# Altium project dctr.PrjPCB
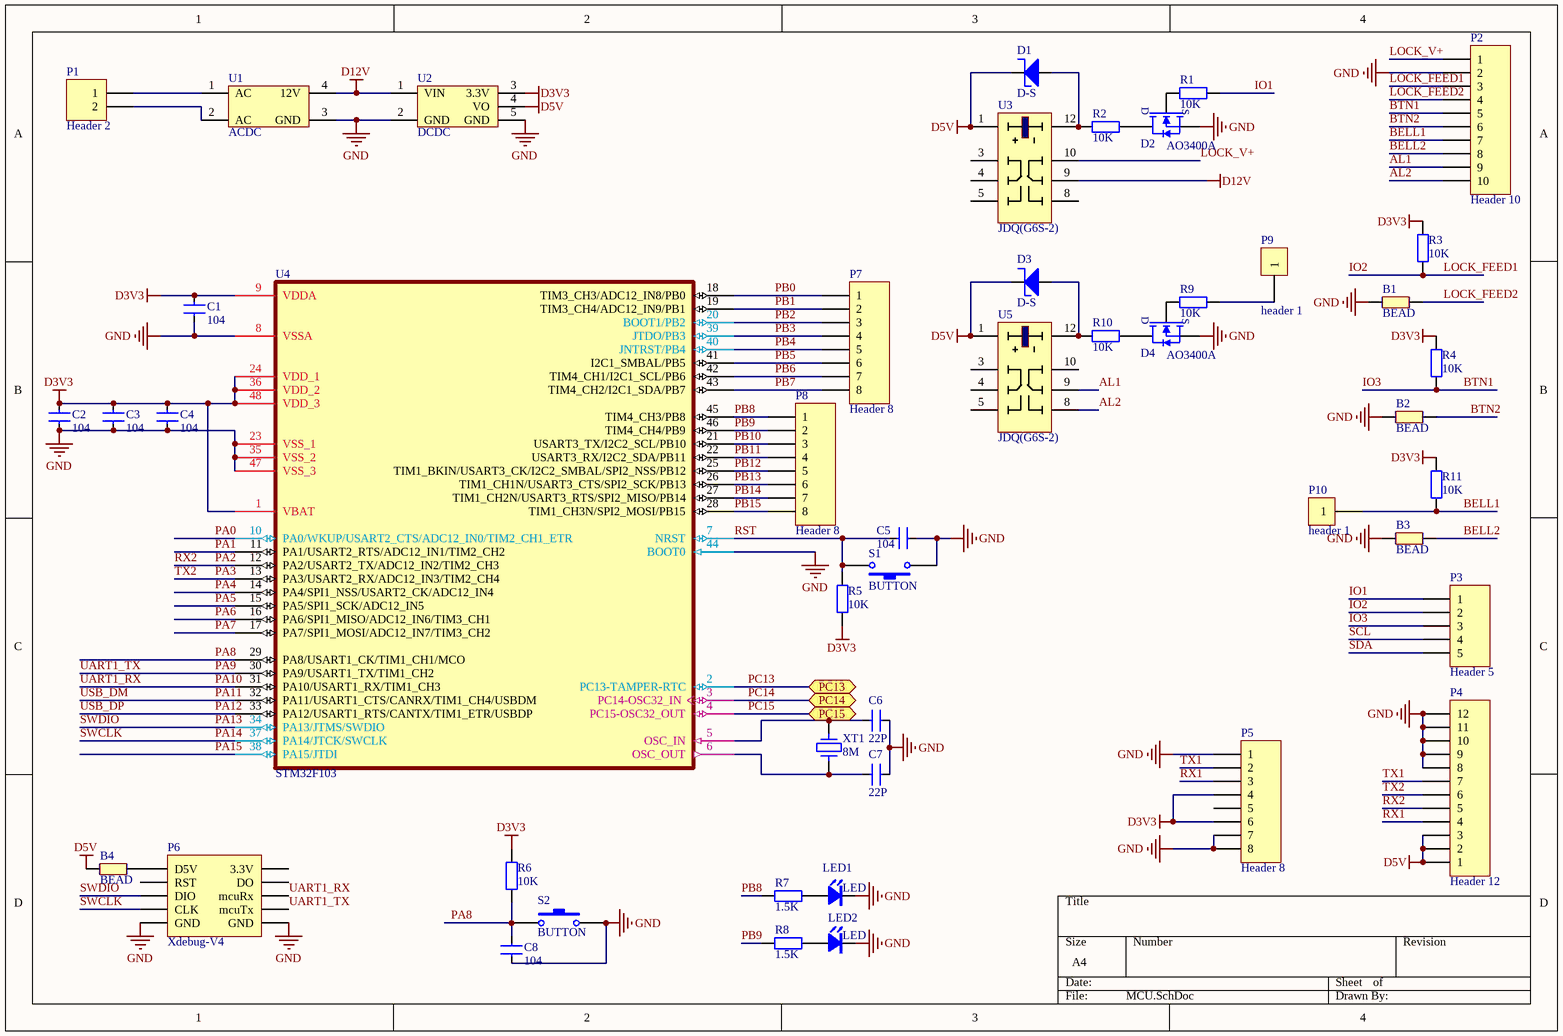
[diagram p0: MCU.SchDoc]
2 sheets, 47 parts. Net scope: flat (ports and power ports of the same name join across sheets).
Board file: dctr_v1.0.pcbDoc
Sheets:
  MCU.SchDoc
  power.SchDoc

## Sheet MCU.SchDoc
size A4

### Parts
B1  BEAD  [0603L]
B2  BEAD  [0603L]
B3  BEAD  [0603L]
B4  BEAD  [0603L]
C1  104  [0603C]
C2  104  [0603C]
C3  104  [0603C]
C4  104  [0603C]
C5  104  [0603C]
C6  22P  [0603C]
C7  22P  [0603C]
C8  104  [0603C]
D1  D-S  [DO-214AC(SMA)]
D2  AO3400A  [SOT23A]
D3  D-S  [DO-214AC(SMA)]
D4  AO3400A  [SOT23A]
LED1  LED  [0805D]
LED2  LED  [0805D]
P1  Header 2  [KF128-5.08-2]
P2  Header 10  [KF128-5.08-10]
P3  Header 5  [HDR1X5]
P4  Header 12  [FFC/SM1.0-2H10]
P5  Header 8  [1.25T-6P]
P6  Xdebug-V4  [DC2.54-10]
P7  Header 8  [HDR1X8]
P8  Header 8  [HDR1X8]
P9  header 1  [HDR1]
P10  header 1  [HDR1]
R1  10K  [0603R]
R2  10K  [0603R]
R3  10K  [0603R]
R4  10K  [0603R]
R5  10K  [0603R]
R6  10K  [0603R]
R7  1.5K  [0603R]
R8  1.5K  [0603R]
R9  10K  [0603R]
R10  10K  [0603R]
R11  10K  [0603R]
S1  BUTTON  [SW-3X4X2]
S2  BUTTON  [SW-3X4X2]
U1  ACDC  [ACDC]
U2  DCDC  [DCDC]
U3  JDQ(G6S-2)  [JDQ-G6S-2]
U4  STM32F103  [LQFP48]
U5  JDQ(G6S-2)  [JDQ-G6S-2]
XT1  8M  [5032]

### Ports
PC13, PC14, PC15

### Nets
D3V3: C1.2 C2.2 C3.1 C4.2 P5.4 P5.6 R3.2 R4.2 R5.1 R6.1 R11.2 U2.3(3.3V) U4.1(VBAT) U4.9(VDDA) U4.24(VDD_1) U4.36(VDD_2) U4.48(VDD_3)
D5V: B4.2 D1.K D3.K P4.1 P4.2 P4.3 U2.4(VO) U3.1 U5.1
D12V: U1.4(12V) U2.1(VIN) U3.9
GND: B1.2 B2.2 B3.2 C1.1 C2.1 C3.2 C4.1 C5.2 C6.2 C7.2 C8.1 D2.2(S) D4.2(S) LED1.K LED2.K P2.2 P4.8 P4.9 P4.10 P4.11 P4.12 P5.1 P5.7 P5.8 P6.9(GND) P6.10(GND) S1.1 S2.2 U1.3(GND) U2.2(GND) U2.5(GND) U4.8(VSSA) U4.23(VSS_1) U4.35(VSS_2) U4.44(BOOT0) U4.47(VSS_3)
AL1: P2.9 U5.9
AL2: P2.10 U5.8
BELL1: P2.7 P10.1 R11.1
BELL2: B3.1 P2.8
BTN1: P2.5 P3.3 R4.1  [also labelled IO3]
BTN2: B2.1 P2.6
IO1: P3.1 R1.2
IO2: P2.3 P3.2 R3.1  [also labelled LOCK_FEED1]
LOCK_FEED2: B1.1 P2.4
LOCK_V+: P2.1 U3.10
PA0: U4.10(PA0/WKUP/USART2_CTS/ADC12_IN0/TIM2_CH1_ETR)
PA1: U4.11(PA1/USART2_RTS/ADC12_IN1/TIM2_CH2)
PA2: P4.5 U4.12(PA2/USART2_TX/ADC12_IN2/TIM2_CH3)  [also labelled RX2]
PA3: P4.6 U4.13(PA3/USART2_RX/ADC12_IN3/TIM2_CH4)  [also labelled TX2]
PA4: U4.14(PA4/SPI1_NSS/USART2_CK/ADC12_IN4)
PA5: U4.15(PA5/SPI1_SCK/ADC12_IN5)
PA6: U4.16(PA6/SPI1_MISO/ADC12_IN6/TIM3_CH1)
PA7: U4.17(PA7/SPI1_MOSI/ADC12_IN7/TIM3_CH2)
PA8: C8.2 R6.2 S2.1 U4.29(PA8/USART1_CK/TIM1_CH1/MCO)
PA9: P6.8(mcuTx) U4.30(PA9/USART1_TX/TIM1_CH2)  [also labelled UART1_TX]
PA10: P6.6(mcuRx) U4.31(PA10/USART1_RX/TIM1_CH3)  [also labelled UART1_RX]
PA11: U4.32(PA11/USART1_CTS/CANRX/TIM1_CH4/USBDM)  [also labelled USB_DM]
PA12: U4.33(PA12/USART1_RTS/CANTX/TIM1_ETR/USBDP)  [also labelled USB_DP]
PA13: P6.5(DIO) U4.34(PA13/JTMS/SWDIO)  [also labelled SWDIO]
PA14: P6.7(CLK) U4.37(PA14/JTCK/SWCLK)  [also labelled SWCLK]
PA15: U4.38(PA15/JTDI)
PB0: P7.1 U4.18(TIM3_CH3/ADC12_IN8/PB0)
PB1: P7.2 U4.19(TIM3_CH4/ADC12_IN9/PB1)
PB2: P7.3 U4.20(BOOT1/PB2)
PB3: P7.4 U4.39(JTDO/PB3)
PB4: P7.5 U4.40(JNTRST/PB4)
PB5: P7.6 U4.41(I2C1_SMBAL/PB5)
PB6: P7.7 U4.42(TIM4_CH1/I2C1_SCL/PB6)
PB7: P7.8 U4.43(TIM4_CH2/I2C1_SDA/PB7)
PB8: P8.1 R7.1 U4.45(TIM4_CH3/PB8)
PB9: P8.2 R8.1 U4.46(TIM4_CH4/PB9)
PB10: P8.3 U4.21(USART3_TX/I2C2_SCL/PB10)
PB11: P8.4 U4.22(USART3_RX/I2C2_SDA/PB11)
PB12: P8.5 U4.25(TIM1_BKIN/USART3_CK/I2C2_SMBAL/SPI2_NSS/PB12)
PB13: P8.6 U4.26(TIM1_CH1N/USART3_CTS/SPI2_SCK/PB13)
PB14: P8.7 U4.27(TIM1_CH2N/USART3_RTS/SPI2_MISO/PB14)
PB15: P8.8 U4.28(TIM1_CH3N/SPI2_MOSI/PB15)
PC13: U4.2(PC13-TAMPER-RTC) ; port PC13
PC14: U4.3(PC14-OSC32_IN) ; port PC14
PC15: U4.4(PC15-OSC32_OUT) ; port PC15
RST: C5.1 R5.2 S1.2 U4.7(NRST)
RX1: P4.4 P5.3
SCL: P3.4
SDA: P3.5
TX1: P4.7 P5.2
NetB4_1: B4.1 P6.1(D5V)
NetC6_1: C6.1 U4.5(OSC_IN) XT1.1
NetC7_1: C7.1 U4.6(OSC_OUT) XT1.2
NetD1_A: D1.A R2.1 U3.12
NetD2_1: D2.1(G) R1.1
NetD2_3: D2.3(D) R2.2
NetD3_A: D3.A R10.1 U5.12
NetD4_1: D4.1(G) R9.1
NetD4_3: D4.3(D) R10.2
NetLED1_A: LED1.A R7.2
NetLED2_A: LED2.A R8.2
NetP1_1: P1.1 U1.1(AC)
NetP1_2: P1.2 U1.2(AC)
NetP9_1: P9.1 R9.2

Not connected (* = marked no-connect by the designer): P5 5; P6 2(3.3V) 3(RST) 4(DO); U3 3 4 5 8; U5 3 4 5 10

### Notes on the sheet
- Labels drawn without touching a wire or pin: ENC1, ENC2, ENC3

### Library data of the parts
B1-B4 = BEAD: 磁珠
C1-C8 = CAP: 普通小电容
D1 D3 = D-S: 肖特基二极管
D2 D4 = MOS-N: NMOS
P1 = Header 2: Header, 2-Pin; LatestRevisionDate: 17-Jul-2002; LatestRevisionNote: Re-released for DXP Platform.; Publisher: Altium Limited
P2 = Header 10: Header, 10-Pin; LatestRevisionDate: 17-Jul-2002; LatestRevisionNote: Re-released for DXP Platform.; Publisher: Altium Limited
P3 = Header 5: Header, 5-Pin; LatestRevisionDate: 17-Jul-2002; LatestRevisionNote: Re-released for DXP Platform.; Publisher: Altium Limited
P4 = Header 12: Header, 12-Pin; LatestRevisionDate: 17-Jul-2002; LatestRevisionNote: Re-released for DXP Platform.; Publisher: Altium Limited
P5 P7 P8 = Header 8: Header, 8-Pin; LatestRevisionDate: 17-Jul-2002; LatestRevisionNote: Re-released for DXP Platform.; Publisher: Altium Limited
P6 = Xdebug-V4: 单片机端
R1-R11 = RES: 普通电阻
U1 = ACDC12
U3 U5 = JDQ(G6S-2): 继电器（G6S-2 5VDC）
XT1 = XT: 晶振

## Sheet power.SchDoc
size A4